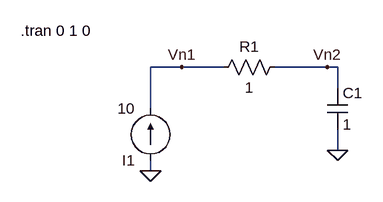
[diagram p0: schematic Draft1.asc]
Draft1.asc, the LTspice schematic file:
Version 4.1
SHEET 1 880 680
WIRE -80 16 -128 16
WIRE -16 16 -80 16
WIRE 144 16 64 16
WIRE 160 16 144 16
WIRE 160 48 160 16
WIRE -128 80 -128 16
WIRE 160 144 160 112
WIRE -128 176 -128 160
FLAG 160 144 0
FLAG -128 176 0
FLAG -80 16 Vn1
FLAG 144 16 Vn2
SYMBOL current -128 160 R180
WINDOW 123 0 0 Left 0
WINDOW 39 0 0 Left 0
SYMATTR InstName I1
SYMATTR Value 10
SYMBOL res 80 0 R90
WINDOW 0 0 56 VBottom 2
WINDOW 3 32 56 VTop 2
SYMATTR InstName R1
SYMATTR Value 1
SYMBOL cap 144 48 R0
SYMATTR InstName C1
SYMATTR Value 1
TEXT -328 -40 Left 2 !.tran 0 1 0

The netlist it stands for:
* Draft1.asc
I1 0 Vn1 10
R1 Vn2 Vn1 1
C1 Vn2 0 1
.tran 0 1 0
.backanno
.end